# EAGLE design VF_FabricaDeUnicorniosMuertos_PCB (EAGLE 9.6.2)
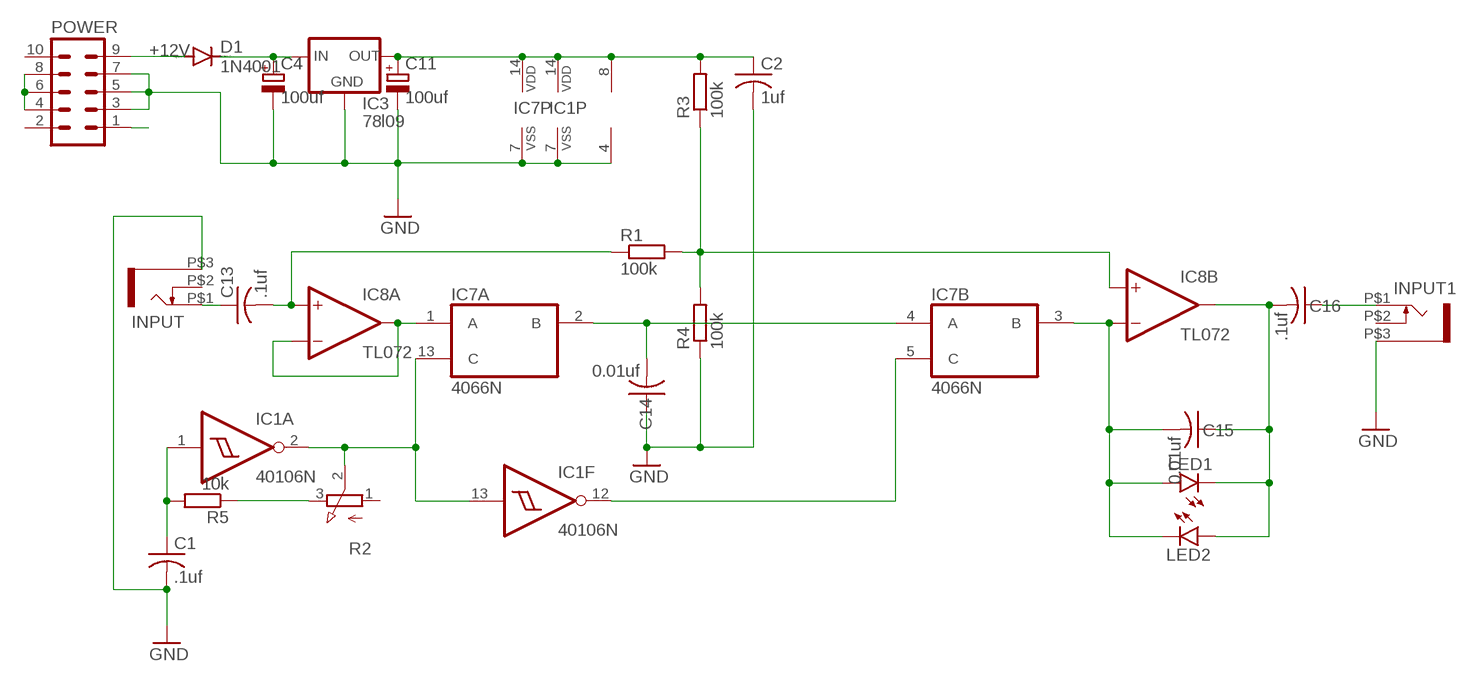
[diagram p0: schematic, sheet 1]

## Parts
C1  .1uf  C-US050-025X075  [C050-025X075]
C2  1uf  C-US050-025X075  [C050-025X075]
C4  100uf  CPOL-EUE2.5-7  [E2,5-7]
C11  100uf  CPOL-EUE2.5-7  [E2,5-7]
C13  .1uf  C-US050-025X075  [C050-025X075]
C14  0.01uf  C-US050-025X075  [C050-025X075]
C15  0.01uf  C-US050-025X075  [C050-025X075]
C16  .1uf  C-US050-025X075  [C050-025X075]
D1  1N4001  1N4004  [DO41-10]
IC1  40106N  [DIL14]
IC3  78l09  78LXX  [78LXX]
IC7  4066N  [DIL14]
IC8  TL072  MCP6002DIL_LONG  [DIL08]
INPUT  WQP-PJ301M-12_JACK  [WQP-PJ301M-12_JACK]
INPUT1  WQP-PJ301M-12_JACK  [WQP-PJ301M-12_JACK]
LED1  LED3MM  [LED3MM]
LED2  LED3MM  [LED3MM]
POWER  10_PIN_HEADER  [MA05-2]
R1  100k  RESISTOR7MM  [7MM_RESISTOR]
R2  EVUF2L  [EVUFXL]
R3  100k  RESISTOR7MM  [7MM_RESISTOR]
R4  100k  RESISTOR7MM  [7MM_RESISTOR]
R5  10k  RESISTOR7MM  [7MM_RESISTOR]

## Nets
+12V [power]: C4.+ D1.C IC3.IN
-12V [power]: POWER.1
GND: C1.2 C2.2 C4.- C11.- C14.1 IC1.7(P:VSS) IC3.GND IC7.7(P:VSS) IC8.4(P:V-) INPUT1.P$3 INPUT.P$3 POWER.3 POWER.5 POWER.7 R4.1
GND2: POWER.4 POWER.6 POWER.8
N$1: C1.1 IC1.1(A:I) R5.2
N$2: C13.1 INPUT.P$1
N$3: C16.1 INPUT1.P$1
N$4: R2.3(E) R5.1
N$5: C15.2 IC7.3(B:B) IC8.6(B:-IN) LED1.A LED2.K(C)
N$6: IC8.5(B:+IN) R1.2 R3.1 R4.2
N$7: IC1.2(A:O) IC1.13(F:I) IC7.13(A:C) R2.2(S)
N$23: D1.A POWER.9
N$25: C2.1 C11.+ IC1.14(P:VDD) IC3.OUT IC7.14(P:VDD) IC8.8(P:V+) R3.2
N$80: C13.2 IC8.3(A:+IN) R1.1
N$82: IC7.1(A:A) IC8.1(A:OUT) IC8.2(A:-IN)
N$83: C14.2 IC7.2(A:B) IC7.4(B:A)
N$84: IC1.12(F:O) IC7.5(B:C)
N$86: C15.1 C16.2 IC8.7(B:OUT) LED1.K(C) LED2.A
Unconnected: IC1.3(B:I) IC1.4(B:O) IC1.5(C:I) IC1.6(C:O) IC1.8(D:O) IC1.9(D:I) IC1.10(E:O) IC1.11(E:I) IC7.6(C:C) IC7.8(C:A) IC7.9(C:B) IC7.10(D:B) IC7.11(D:A) IC7.12(D:C) INPUT1.P$2 INPUT.P$2 POWER.2 POWER.10 R2.1(A)

## Library data of the parts
C1 C2 C13-C16 = rcl:C-US: CAPACITOR, American symbol; SPICEPREFIX: C
C4 C11 = rcl:CPOL-EU: POLARIZED CAPACITOR, European symbol; SPICEPREFIX: C
D1 = diode:1N4004: DIODE general purpose rectifier, 1 A
IC1 = 40xx:40106: Hex SCHMITT TRIGGER
IC3 = v-reg:78LXX: VOLTAGE REGULATOR
IC7 = 40xx:4066: Quad bilateral ANALOG SWITCH
IC8 = MusicThingModular:MCP6002: Generic Dual Op Amp
INPUT INPUT1 = thonkiconn:WQP-PJ301M-12_JACK
LED1 LED2 = led:LED: LED OSRAM: - CHIPLED LG R971, LG N971, LY N971, LG Q971, LY Q971, LO R971, LY R971 LH N974, LH R974 LS Q976, LO Q976, LY Q976 LO Q996 - Hyper CHIPLED LW Q18S LB Q993, LB Q99A, LB R99A - SideLED LS A670, LO A670, LY A670, LG A670, LP A670 LB A673, LV A673, LT A673, LW A673 LH A674 LY A675 LS A676, LA A676, LO A676, LY A676, LW A676 LS A679, LY A679, LG A679 - Hyper Micro SIDELED® LS Y876, LA Y876, LO Y876, LY Y876 LT Y87S - SmartLED LW L88C, LW L88S LB L89C, LB L89S, LG L890 LS L89K, LO L89K, LY L89K LS L896, LA L896, LO L896, LY L896 - TOPLED LS T670, LO T670, LY T670, LG T670, LP T670 LSG T670, LSP T670, LSY T670, LOP T670, LYG T670 LG T671, LOG T671, LSG T671 LB T673, LV T673, LT T673, LW T673 LH T674 LS T676, LA T676, LO T676, LY T676, LB T676, LH T676, LSB T676, LW T676 LB T67C, LV T67C, LT T67C, LS T67K, LO T67K, LY T67K, LW E67C LS E67B, LA E67B, LO E67B, LY E67B, LB E67C, LV E67C, LT E67C LW T67C LS T679, LY T679, LG T679 LS T770, LO T770, LY T770, LG T770, LP T770 LB T773, LV T773, LT T773, LW T773 LH T774 LS E675, LA E675, LY E675, LS T675 LS T776, LA T776, LO T776, LY T776, LB T776 LHGB T686 LT T68C, LB T68C - Hyper Mini TOPLED® LB M676 - Mini TOPLED Santana® LG M470 LS M47K, LO M47K, LY M47K Source: http://www.osram.convergy.de LUXEON: - LUMILED® LXK2-PW12-R00, LXK2-PW12-S00, LXK2-PW14-U00, LXK2-PW14-V00 LXK2-PM12-R00, LXK2-PM12-S00, LXK2-PM14-U00 LXK2-PE12-Q00, LXK2-PE12-R00, LXK2-PE12-S00, LXK2-PE14-T00, LXK2-PE14-U00 LXK2-PB12-K00, LXK2-PB12-L00, LXK2-PB12-M00, LXK2-PB14-N00, LXK2-PB14-P00, LXK2-PB14-Q00 LXK2-PR12-L00, LXK2-PR12-M00, LXK2-PR14-Q00, LXK2-PR14-R00 LXK2-PD12-Q00, LXK2-PD12-R00, LXK2-PD12-S00 LXK2-PH12-R00, LXK2-PH12-S00 LXK2-PL12-P00, LXK2-PL12-Q00, LXK2-PL12-R00 Source: www.luxeon.com KINGBRIGHT: KA-3528ASYC Source: www.kingbright.com
POWER = TomW:10_PIN_HEADER: PIN HEADER; OC_FARNELL: unknown; OC_NEWARK: unknown
R1 R3-R5 = MusicThingModular:RESISTOR: Standard resistor, various versions
R2 = pot:EVU: 9 mm Square Rotary Potentiometers Source: Panasonic

## Net classes
1 power: width 0.61 mm

## Board
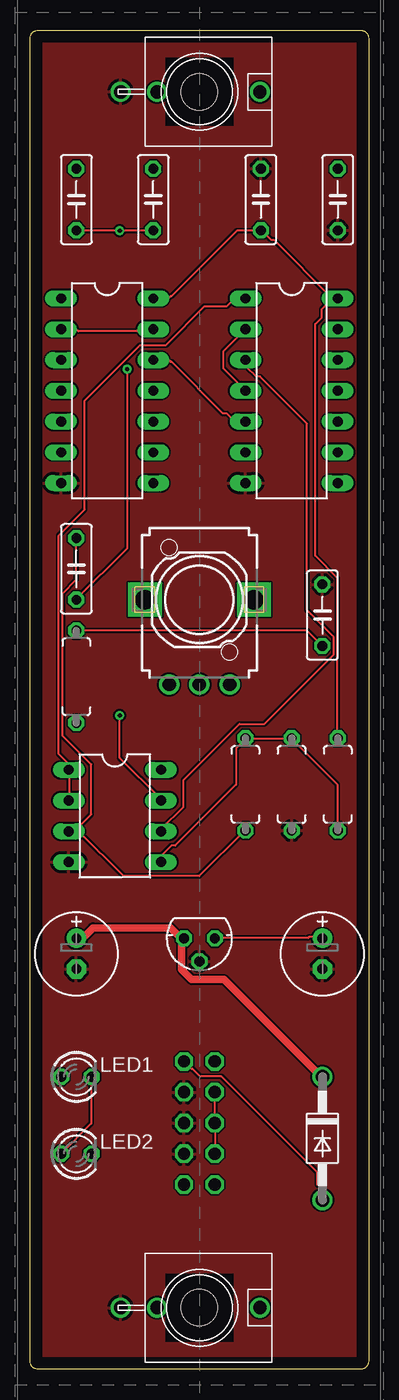
[diagram p1: board, top side]
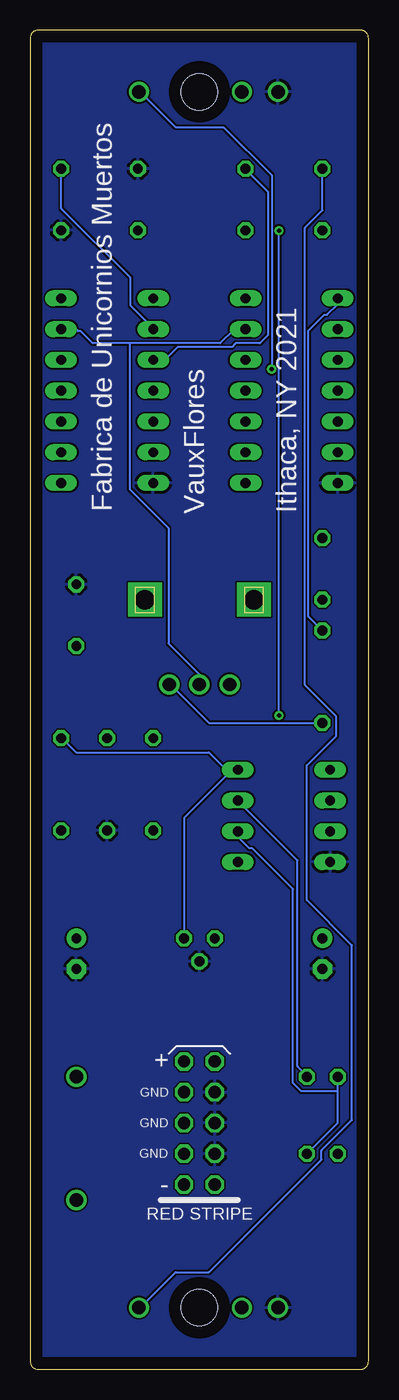
[diagram p2: board, bottom side, seen from below]

Size 27.94 x 110.49 mm. Coordinates in mm from the lower left corner, seen from the top.
Copper layers (1*16): Top 0.035mm / dielectric 1.5mm / Bottom 0.035mm
Design rules "default": minimum track width 6mil, minimum drill 0.35mm, track to track 6mil, track to pad 6mil, pad to pad 6mil, via to via 6mil, smd to smd 6mil, copper to edge 40mil, drill to drill 6mil, minimum pad ring 10mil, minimum via ring 8mil, stop-mask expansion 4mil, vias tented up to drill 0mil, thermal gap 10mil
Holes 3 mm at 13.97,105.41 13.97,5.08

### Footprints (pad centres in the part's own frame; a part is rotated, then mirrored left to right if it is on the bottom)
C050-025X075 = drill 0.813 octagon: 1 -2.54,0; 2 2.54,0
E2,5-7 = drill 0.813 pad 1.6: + -1.27,0 | drill 0.813 pad 1.6 octagon: - 1.27,0
DO41-10 = drill 1.118: A 5.08,0; C -5.08,0
DIL14 = drill 0.813 long: 1 -7.62,-3.81; 2 -5.08,-3.81; 3 -2.54,-3.81; 4 0,-3.81; 5 2.54,-3.81; 6 5.08,-3.81; 7 7.62,-3.81; 8 7.62,3.81; 9 5.08,3.81; 10 2.54,3.81; 11 0,3.81; 12 -2.54,3.81; 13 -5.08,3.81; 14 -7.62,3.81
78LXX = drill 0.813 octagon: GND 0,1.905; IN 1.27,0; OUT -1.27,0
DIL08 = drill 0.813 pad 1.27 long: 1 -3.81,-3.81; 2 -1.27,-3.81; 3 1.27,-3.81; 4 3.81,-3.81; 5 3.81,3.81; 6 1.27,3.81; 7 -1.27,3.81; 8 -3.81,3.81
WQP-PJ301M-12_JACK = drill 1.1: P$1 0,5; P$2 0,-3.5; P$3 0,-6.5
LED3MM = drill 0.813 octagon: A -1.27,0; K 1.27,0
MA05-2 = drill 1.016 octagon: 1 -5.08,-1.27; 2 -5.08,1.27; 3 -2.54,-1.27; 4 -2.54,1.27; 5 0,-1.27; 6 0,1.27; 7 2.54,-1.27; 8 2.54,1.27; 9 5.08,-1.27; 10 5.08,1.27
7MM_RESISTOR = drill 0.813 octagon: 1 -3.81,0; 2 3.81,0
EVUFXL = drill 1.1 pad 1.676: 1 -2.5,-7; 2 0,-7; 3 2.5,-7 | drill 1.6 pad 2.8 square: M1 4.5,0; M2 -4.5,0

### Placement (x,y rotation side)
C1  24.13,62.23 90 top
C2  19.05,96.52 90 top
C4  3.81,34.29 270 top
C11  24.13,34.29 270 top
C13  3.81,66.04 90 top
C14  25.4,96.52 90 top
C15  10.16,96.52 90 top
C16  3.81,96.52 270 top
D1  24.13,19.05 270 top
IC1  6.35,80.75 270 top
IC3  13.97,35.56 180 top
IC7  21.59,80.75 270 top
IC8  6.99,45.66 270 top
INPUT  13.97,105.41 270 top
INPUT1  13.97,5.08 270 top
LED1  3.81,24.13 0 top
LED2  3.81,17.78 0 top
POWER  13.97,20.32 90 bottom
R1  17.78,48.26 90 top
R2  13.97,63.5 0 top
R3  25.4,48.26 90 top
R4  21.59,48.26 90 top
R5  3.81,57.15 90 top
U$1  [EURO_PCB_6HP]  -1.27,-8.89 0 top  (outside the outline)

### Tracks (layer width: path | path; a pad name or v marks a point on that pad's centre or on a via)
+12V
  Top 0.61: C4.+ 3.81,35.59 4.27,35.59 4.5,35.81 4.57,35.81 5.18,36.42 11.58,36.42 12.42,35.59 12.65,35.59 IC3.IN 12.8,35.28 12.5,34.98 12.5,32.99 13.34,32.16 16,32.16 23.7,24.46 23.77,24.46 24.08,24.16 D1.C
GND
  pour Top (rank 3): 0,110.49 27.94,110.49 27.94,0 0,0
  pour Bottom (rank 3): 0,110.49 27.94,110.49 27.94,0 0,0
GND2
  Top 0.152: POWER.4 POWER.6 POWER.8
N$1
  Top 0.152: R5.2 22.86,60.96 C1.1
  Bottom 0.152: R5.2 4.95,62.1 4.95,85.72 3.66,87.02 3.43,87.02 2.59,87.86 2.59,88.32 IC1.1
N$2  (via drill 0.35)
  Top 0.152: v8,82.53 8,67.74 3.81,63.55 C13.1
  Bottom 0.152: v8,82.53 8,98.53 11.96,102.49 15.93,102.49 18.9,105.46 INPUT.P$1
N$3
  Bottom 0.152: C16.1 3.81,95.63 5.26,94.18 5.26,56.46 2.67,53.87 2.67,52.27 5.11,49.84 5.11,38.71 1.37,34.98 1.37,20.57 3.89,18.06 3.89,17.3 13.18,8 15.93,8 18.9,5.03 INPUT1.P$1
N$4
  Bottom 0.152: R5.1 13.18,53.34 16.31,56.46 16.46,56.46 R2.3
N$5
  Top 0.152: IC7.3 17.83,83.29 17.83,82.75 18.67,81.92 18.97,81.92 22.86,78.03 22.86,62.64 25.07,60.43 25.07,58.98 19.36,53.26 17.3,53.26 12.65,48.62 12.65,46.41 10.82,44.58 10.82,44.42 IC8.6
  Bottom 0.152: IC7.3 16.84,83.29 15.77,84.35 11.28,84.35 10.97,84.66 8.99,84.66 8.31,85.34 8.31,97.16 10.21,99.06 C15.2 | LED2.K 2.59,20.27 2.59,22.94 | 2.59,22.94 2.59,24.08 LED1.A | 2.59,22.94 5.56,22.94 6.25,23.62 6.25,39.62 9.6,42.98 9.83,42.98 10.74,43.89 10.74,44.35 IC8.6
N$6
  Top 0.152: IC8.5 10.82,41.91 10.82,42.37 11.66,43.2 11.96,43.2 16.99,48.23 16.99,51.21 17.83,52.05 R1.2 17.91,52.05 21.57,52.05 | 21.57,52.05 25.38,48.23 25.38,44.5 R3.1 | 21.57,52.05 R4.2
N$7
  Top 0.152: IC1.2 2.59,85.8 3.81,85.8 3.96,85.65 8.84,85.65 8.99,85.8 10.13,85.8 IC1.13
  Bottom 0.152: 19.74,84.66 12.27,84.66 11.12,85.8 10.21,85.8 IC1.13 | 19.74,84.66 22.78,84.66 23.77,85.65 24,85.65 24.16,85.8 25.38,85.8 IC7.13 | 19.74,84.66 19.74,72.62 16.54,69.42 16.54,59.89 14.02,57.38 14.02,56.54 R2.2
N$23
  Top 0.152: POWER.9 13.34,24.77 13.41,24.77 14.02,24.16 15.77,24.16 23.7,16.23 23.7,15.24 24.16,14.78 24.16,14.02 D1.A
N$25
  Top 0.152: IC1.14 10.21,88.39 11.43,88.39 11.58,88.54 11.66,88.54 17.07,93.95 19.05,93.95 C2.1 19.05,94.03 19.89,93.19 20.12,93.19 24.92,88.39 25.38,88.39 IC7.14 24.84,88.39 24.84,88.24 24.08,87.48 24.08,86.79 23.55,86.26 23.55,67.13 25.38,65.3 25.38,52.12 R3.2 | IC3.OUT 15.24,35.59 22.94,35.59 23.01,35.66 24,35.66 24.08,35.59 C11.+
  Bottom 0.152: 11.81,49.53 10.82,49.53 IC8.8 11.81,49.53 | 11.81,49.53 13.18,50.9 24.16,50.9 25.38,52.12 R3.2 | IC3.OUT 15.24,45.49 11.81,48.92 11.81,49.53
N$80
  Top 0.152: R1.1 17.75,44.5 13.95,40.69 7.7,40.69 4.04,44.35 3.2,44.35 IC8.3 4.12,44.35 4.12,44.88 5.03,45.8 5.03,49.91 2.67,52.27 2.67,64.01 3.81,65.15 C13.2
N$82
  Top 0.152: IC8.2 3.2,46.94 3.2,49.45 IC8.1 3.12,49.53 3.12,49.99 2.36,50.75 2.36,68.81 4.5,70.94 4.5,79.93 9.07,84.51 11.2,84.51 14.4,87.71 16.23,87.71 16.84,88.32 17.75,88.32 IC7.1
N$83
  Top 0.152: IC7.4 15.93,82.6 15.93,83.97 IC7.2
  Bottom 0.152: C14.2 25.38,99.06 25.38,95.78 19.66,90.07 19.66,87.78 17.75,85.88 IC7.2
N$84
  Top 0.152: IC1.12 11.43,83.29 11.58,83.13 11.66,83.13 15.93,78.87 16.23,78.87 16.84,78.26 17.75,78.26 IC7.5
N$86  (via drill 0.35)
  Top 0.152: C16.2 3.81,93.95 v7.39,93.95 10.13,93.95 C15.1 | LED2.A 5.03,20.27 5.03,24.08 LED1.K | v7.39,53.95 7.39,50.44 10.74,47.09 10.74,46.94 IC8.7
  Bottom 0.152: IC8.7 10.74,46.86 5.87,41.99 5.87,24.99 5.03,24.16 LED1.K | v7.39,53.95 v7.39,93.95

### Text on the board
bNames: Fabrica de Unicornios Muertos | Ithaca, NY 2021 | VauxFlores
tValues: In | Freq | 100k | TL072 | Out
bValues: Inspired by Peter B & Delton Horn